# Altium schematic sheet USB.SchDoc
size Letter
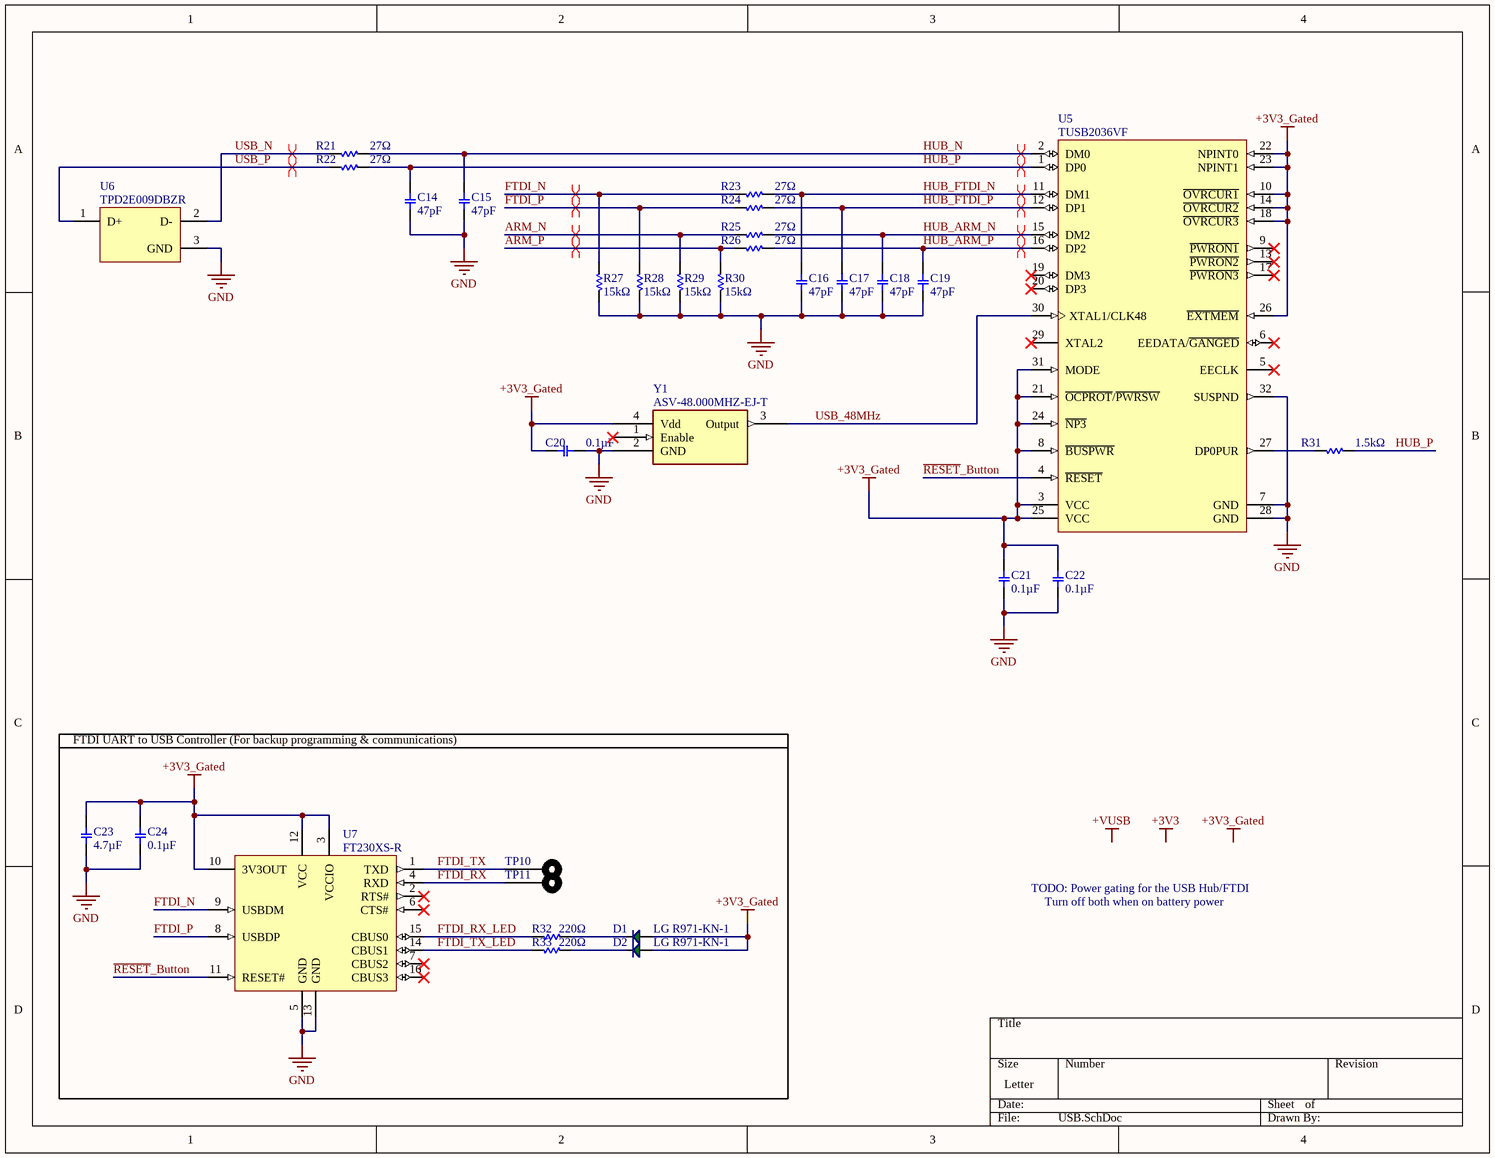
[diagram p0: USB.SchDoc]

## Parts
C14  47pF  [C0805(2012)_NP_med]
C15  47pF  [C0805(2012)_NP_med]
C16  47pF  [C0805(2012)_NP_med]
C17  47pF  [C0805(2012)_NP_med]
C18  47pF  [C0805(2012)_NP_med]
C19  47pF  [C0805(2012)_NP_med]
C20  0.1µF  [C0805(2012)_NP_med]
C21  0.1µF  [C0805(2012)_NP_med]
C22  0.1µF  [C0805(2012)_NP_med]
C23  4.7µF  [C0805(2012)_NP_med]
C24  0.1µF  [C0805(2012)_NP_med]
D1  LG R971-KN-1  [C0805(2012)_P_med]
D2  LG R971-KN-1  [C0805(2012)_P_med]
R21  27Ω  [R0805(2012)_med]
R22  27Ω  [R0805(2012)_med]
R23  27Ω  [R0805(2012)_med]
R24  27Ω  [R0805(2012)_med]
R25  27Ω  [R0805(2012)_med]
R26  27Ω  [R0805(2012)_med]
R27  15kΩ  [R0805(2012)_med]
R28  15kΩ  [R0805(2012)_med]
R29  15kΩ  [R0805(2012)_med]
R30  15kΩ  [R0805(2012)_med]
R31  1.5kΩ  [R0805(2012)_med]
R32  220Ω  [R0805(2012)_med]
R33  220Ω  [R0805(2012)_med]
TP10  Testpoint  [TESTPOINT]  (value not drawn)
TP11  Testpoint  [TESTPOINT]  (value not drawn)
U5  TUSB2036VF  [VF32_M]
U6  TPD2E009DBZR  [DBZ3_N]
U7  FT230XS-R  [SSOP-16_M]
Y1  ASV-48.000MHZ-EJ-T  [Abracon ASV XO]

## Nets
+3V3_Gated: C20.1 C21.1 C22.1 C23.1 C24.1 D1.2(A) D2.2(A) U5.3(VCC) U5.8(~{BUSPWR}) U5.10(~{OVRCUR1}) U5.14(~{OVRCUR2}) U5.18(~{OVRCUR3}) U5.21(~{OCPROT}/~{PWRSW}) U5.22(NPINT0) U5.23(NPINT1) U5.24(~{NP3}) U5.25(VCC) U5.26(~{EXTMEM}) U5.31(MODE) U7.3(VCCIO) U7.10(3V3OUT) U7.12(VCC) Y1.4(Vdd)
GND: C14.2 C15.2 C16.2 C17.2 C18.2 C19.2 C20.2 C21.2 C22.2 C23.2 C24.2 R27.1 R28.1 R29.1 R30.1 U5.7(GND) U5.28(GND) U5.32(SUSPND) U6.3(GND) U7.5(GND) U7.13(GND) Y1.2(GND)
ARM_N: R25.1 R29.2
ARM_P: R26.1 R30.2
FTDI_N: R23.1 R27.2 U7.9(USBDM)
FTDI_P: R24.1 R28.2 U7.8(USBDP)
FTDI_RX: TP11.1 U7.4(RXD)
FTDI_RX_LED: R32.2 U7.15(CBUS0)
FTDI_TX: TP10.1 U7.1(TXD)
FTDI_TX_LED: R33.2 U7.14(CBUS1)
HUB_ARM_N: C18.1 R25.2 U5.15(DM2)
HUB_ARM_P: C19.1 R26.2 U5.16(DP2)
HUB_FTDI_N: C16.1 R23.2 U5.11(DM1)
HUB_FTDI_P: C17.1 R24.2 U5.12(DP1)
HUB_N: C15.1 R21.2 U5.2(DM0)
HUB_P: C14.1 R22.2 R31.2 U5.1(DP0)
~{RESET}_Button: U5.4(~{RESET}) U7.11(RESET#)
USB_48MHz: U5.30(XTAL1/CLK48) Y1.3(Output)
USB_N: R21.1 U6.2(D-)
USB_P: R22.1 U6.1(D+)
NetD1_1: D1.1(K) R32.1
NetD2_1: D2.1(K) R33.1
NetR31_1: R31.1 U5.27(DP0PUR)

Not connected (* = marked no-connect by the designer): U5 5(EECLK)* 6(EEDATA/~{GANGED})* 9(~{PWRON1})* 13(~{PWRON2})* 17(~{PWRON3})* 19(DM3)* 20(DP3)* 29(XTAL2)*; U7 2(RTS#)* 6(CTS#)* 7(CBUS2)* 16(CBUS3)*; Y1 1(Enable)*

## Layout directives
differential pair: ARM_N, ARM_P, FTDI_N, FTDI_P, HUB_ARM_N, HUB_ARM_P, HUB_FTDI_N, HUB_FTDI_P, HUB_N, HUB_P, USB_N, USB_P

## Notes on the sheet
- FTDI UART to USB Controller (For backup programming & communications)
- TODO: Power gating for the USB Hub/FTDI
- Turn off both when on battery power
- Labels drawn without touching a wire or pin: +3V3, +3V3_Gated, +VUSB

## Library data of the parts
C14-C24 = CPN_SMT: SMT Capacitor; Tolerance: X7R; Rating: 16v
  C14-C19: Value: 47pF
  C20-C22 C24: Value: 0.1µF
  C23: Value: 4.7µF
D1 D2 = DIODE_sMT: SMT LED; Manufacturer: AVX; Part Number: SD0805S020S1R0; Digikey #: 478-7800-1-ND
R21-R33 = RES_SMT: SMT resistor; Tolerance: 1%
  R21-R26: Value: 27Ω
  R27-R30: Value: 15kΩ
  R31: Value: 1.5kΩ
  R32 R33: Value: 220Ω
TP10 TP11 = Testpoint: A single hole in the board
U5 = TUSB2036VF: 2 / 3-Port Hub for USB with Optional Serial EEPROM Interface, 3.3V, 0 to 70 degC, 32-Pin LQFP (VF), Green (RoHS & no Sb/Br); Manufacturer: Texas Instruments; SubFamily: USB Hub Controller; USB Speed: Full; USB Full Speed: True; Supply Voltage(s)(V): 3.3; DatasheetVersion: SLLS372E; PackageVersion: revD, Apr-2000; PackageReference: VF32; PackageDescription: 32-Pin Plastic Quad Flatpack, 7 x 7 mm Body, 0.8 mm Pitch; PartNumber: TUSB2036VF; Mounting Technology: Surface Mount; Eco-Plan: Green (RoHS & no Sb/Br); Integrated MCU Architecture: N/A; ComponentLink1Description: Datasheet; ComponentLink1URL: http://www.ti.com/general/docs/lit/getliterature.tsp?genericPartNumber=TUSB2036&fileType=pdf; ComponentLink2Description: Package Specification; ComponentLink2URL: http://www.ti.com/litv/pdf/mtqf002b
U6 = TPD2E009DBZR: ESD Protection Array for High-Speed Data Interfaces, 2 Channels, -40 to +85 degC, 3-pin SOT-23 (DBZ), Green (RoHS & no Sb/Br); Manufacturer: Texas Instruments; Breakdown Voltage(Min)(V): 9; Differential Capacitance(pF): 0.01; IEC 61000-4-2 Air-Gap(+/- kV): 8; IO Capacitance(Typ)(pF): 0.7; IO Leakage Current(nA): 10; Serial ATA / eSATA: TRUE; SubFamily: ESD Solution; DatasheetVersion: SLVS953A; PackageVersion: revB, Apr-2005; PackageReference: DBZ3; PackageDescription: 3-Pin Plastic Small-Outline Package, 0.95 mm Pitch, 2.4 mm Lead Span; Supplier 1: Digi-Key; Supplier Part Number 1: 296-24657-2-ND; Supplier 2: Digi-Key; Supplier Part Number 2: 296-24657-1-ND; Supplier 3: Digi-Key; Supplier Part Number 3: 296-24657-6-ND; Supplier 4: Farnell; Supplier Part Number 4: 1755715RL; Supplier 5: Farnell; Supplier Part Number 5: 1755715; Supplier 6: Newark; Supplier Part Number 6: 14R9549; Supplier 7: Mouser; Supplier Part Number 7: 595-TPD2E009DBZR; Eco-Plan: Green (RoHS & no Sb/Br); IEC 61000-4-2 Contact(+/- kV): 8; Mounting Technology: Surface Mount; Code_JEDEC: TO-236-AB; PartNumber: TPD2E009DBZR; ComponentLink1Description: Datasheet; ComponentLink1URL: http://www.ti.com/general/docs/lit/getliterature.tsp?genericPartNumber=TPD2E009&fileType=pdf; ComponentLink2Description: URL Link1; ComponentLink2URL: SamplesURL:http://www.ti.com/product/tpd2e009#samples
U7 = FT230XS-R: USB to Basic UART Interface Chip, UHCI/OHCI/EHCI Compatible, USB 2.0 Compatible, -40 to +85 degC, 16-Pin SSOP, Pb-Free, Tape and Reel; Manufacturer: FTDI; DatasheetVersion: ver 1.2, Feb-2013; PackageVersion: Feb-13; PackageReference: SSOP-16; PackageDescription: 16-Pin Small Outline Package, 8.6 x 3.9 mm Body, 0.635 mm Pitch; Code_JEDEC: MO-137-AB; PartNumber: FT230XS-R; ComponentLink1Description: Manufacturer URL; ComponentLink1URL: http://www.ftdichip.com/; ComponentLink2Description: Datasheet; ComponentLink2URL: http://www.ftdichip.com/Support/Documents/DataSheets/ICs/DS_FT230X.pdf; ComponentLink3Description: FT230X Product Page; ComponentLink3URL: www.ftdichip.com/Products/ICs/FT230X.html
Y1 = Abacrom ASV Series: OSC XO X.000MHZ HCMOS SMD